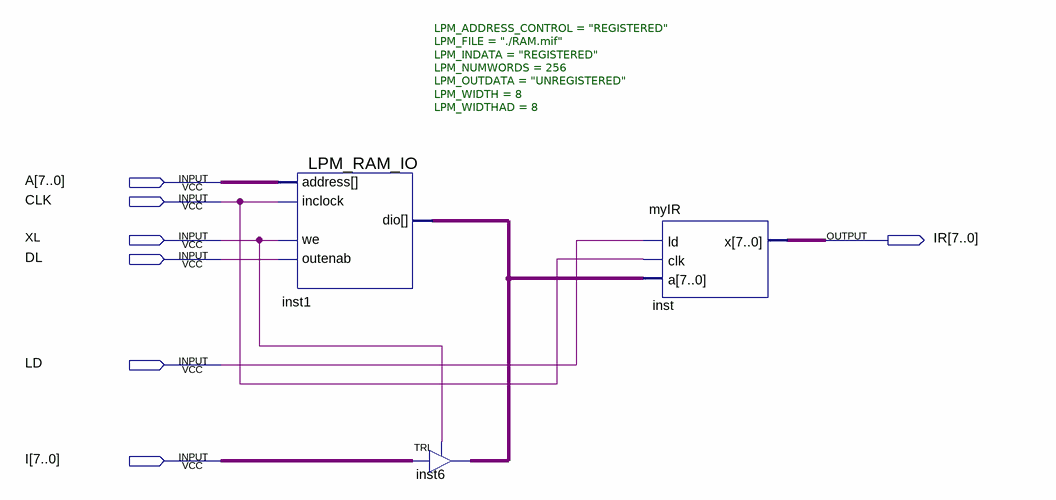
[diagram p0: schematic sheet]
// Quartus schematic RAM.bdf as structural Verilog: 3 symbols, 7 pins
module RAM (
  input  [7:0] A,
  input  CLK,
  input  XL,
  input  DL,
  input  LD,
  input  [7:0] I,
  output [7:0] IR
);

  wire [7:0] inst1_dio;

  LPM_RAM_IO #(.LPM_ADDRESS_CONTROL("REGISTERED"), .LPM_FILE("./RAM.mif"), .LPM_INDATA("REGISTERED"), .LPM_NUMWORDS(256), .LPM_OUTDATA("UNREGISTERED"), .LPM_WIDTH(8), .LPM_WIDTHAD(8)) inst1 (
    .address(A), .inclock(CLK), .we(XL), .outenab(DL), .dio(inst1_dio));
  TRI inst6[7:0] (.IN(I), .OE(XL), .OUT(inst1_dio));
  myIR inst (.ld(LD), .clk(CLK), .a(inst1_dio), .x(IR));
endmodule
